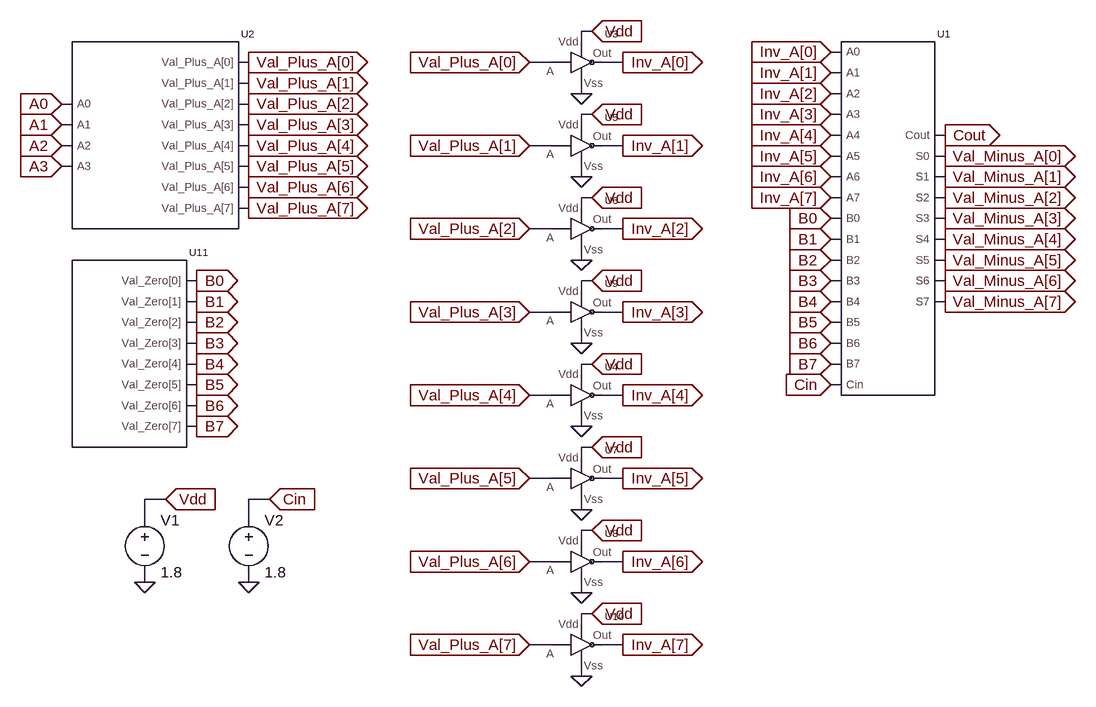
[diagram p0: schematic Val_Minus_A.asc]
Val_Minus_A.asc, the LTspice schematic file:
Version 4
SHEET 1 1636 744
WIRE 320 -640 304 -640
WIRE 304 -624 304 -640
WIRE 704 -608 688 -608
WIRE -208 -592 -224 -592
WIRE 256 -592 224 -592
WIRE 368 -592 336 -592
WIRE 704 -576 688 -576
WIRE -208 -560 -224 -560
WIRE 304 -544 304 -560
WIRE 704 -544 688 -544
WIRE -480 -528 -496 -528
WIRE -208 -528 -224 -528
WIRE 320 -512 304 -512
WIRE 704 -512 688 -512
WIRE -480 -496 -496 -496
WIRE -208 -496 -224 -496
WIRE 304 -496 304 -512
WIRE 704 -480 688 -480
WIRE 864 -480 848 -480
WIRE -480 -464 -496 -464
WIRE -208 -464 -224 -464
WIRE 256 -464 224 -464
WIRE 368 -464 336 -464
WIRE 704 -448 688 -448
WIRE 864 -448 848 -448
WIRE -480 -432 -496 -432
WIRE -208 -432 -224 -432
WIRE 304 -416 304 -432
WIRE 704 -416 688 -416
WIRE 864 -416 848 -416
WIRE -208 -400 -224 -400
WIRE 320 -384 304 -384
WIRE 704 -384 688 -384
WIRE 864 -384 848 -384
WIRE -208 -368 -224 -368
WIRE 304 -368 304 -384
WIRE 704 -352 688 -352
WIRE 864 -352 848 -352
WIRE 256 -336 224 -336
WIRE 368 -336 336 -336
WIRE 704 -320 688 -320
WIRE 864 -320 848 -320
WIRE 304 -288 304 -304
WIRE 704 -288 688 -288
WIRE 864 -288 848 -288
WIRE -288 -256 -304 -256
WIRE 320 -256 304 -256
WIRE 704 -256 688 -256
WIRE 864 -256 848 -256
WIRE 304 -240 304 -256
WIRE -288 -224 -304 -224
WIRE 704 -224 688 -224
WIRE 864 -224 848 -224
WIRE 256 -208 224 -208
WIRE 368 -208 336 -208
WIRE -288 -192 -304 -192
WIRE 704 -192 688 -192
WIRE -288 -160 -304 -160
WIRE 304 -160 304 -176
WIRE 704 -160 688 -160
WIRE -288 -128 -304 -128
WIRE 320 -128 304 -128
WIRE 704 -128 688 -128
WIRE 304 -112 304 -128
WIRE -288 -96 -304 -96
WIRE 704 -96 688 -96
WIRE 256 -80 224 -80
WIRE 368 -80 336 -80
WIRE -288 -64 -304 -64
WIRE -288 -32 -304 -32
WIRE 304 -32 304 -48
WIRE 320 0 304 0
WIRE 304 16 304 0
WIRE 256 48 224 48
WIRE 368 48 336 48
WIRE -336 80 -368 80
WIRE -176 80 -208 80
WIRE 304 96 304 80
WIRE -368 112 -368 80
WIRE -208 112 -208 80
WIRE 320 128 304 128
WIRE 304 144 304 128
WIRE 256 176 224 176
WIRE 368 176 336 176
WIRE -368 208 -368 192
WIRE -208 208 -208 192
WIRE 304 224 304 208
WIRE 320 256 304 256
WIRE 304 272 304 256
WIRE 256 304 224 304
WIRE 368 304 336 304
WIRE 304 352 304 336
FLAG 304 -544 0
FLAG 320 -640 Vdd
IOPIN 320 -640 In
FLAG 304 -416 0
FLAG 320 -512 Vdd
IOPIN 320 -512 In
FLAG 304 -288 0
FLAG 320 -384 Vdd
IOPIN 320 -384 In
FLAG 304 -160 0
FLAG 320 -256 Vdd
IOPIN 320 -256 In
FLAG -208 -592 Val_Plus_A[0]
IOPIN -208 -592 Out
FLAG -208 -560 Val_Plus_A[1]
IOPIN -208 -560 Out
FLAG -208 -528 Val_Plus_A[2]
IOPIN -208 -528 Out
FLAG -208 -496 Val_Plus_A[3]
IOPIN -208 -496 Out
FLAG -208 -464 Val_Plus_A[4]
IOPIN -208 -464 Out
FLAG -208 -432 Val_Plus_A[5]
IOPIN -208 -432 Out
FLAG -208 -400 Val_Plus_A[6]
IOPIN -208 -400 Out
FLAG -208 -368 Val_Plus_A[7]
IOPIN -208 -368 Out
FLAG 224 -592 Val_Plus_A[0]
IOPIN 224 -592 In
FLAG 224 -464 Val_Plus_A[1]
IOPIN 224 -464 In
FLAG 224 -336 Val_Plus_A[2]
IOPIN 224 -336 In
FLAG 224 -208 Val_Plus_A[3]
IOPIN 224 -208 In
FLAG 304 -32 0
FLAG 320 -128 Vdd
IOPIN 320 -128 In
FLAG 304 96 0
FLAG 320 0 Vdd
IOPIN 320 0 In
FLAG 304 224 0
FLAG 320 128 Vdd
IOPIN 320 128 In
FLAG 304 352 0
FLAG 320 256 Vdd
IOPIN 320 256 In
FLAG 224 -80 Val_Plus_A[4]
IOPIN 224 -80 In
FLAG 224 48 Val_Plus_A[5]
IOPIN 224 48 In
FLAG 224 176 Val_Plus_A[6]
IOPIN 224 176 In
FLAG 224 304 Val_Plus_A[7]
IOPIN 224 304 In
FLAG 368 -592 Inv_A[0]
IOPIN 368 -592 Out
FLAG 368 -464 Inv_A[1]
IOPIN 368 -464 Out
FLAG 368 -336 Inv_A[2]
IOPIN 368 -336 Out
FLAG 368 -80 Inv_A[4]
IOPIN 368 -80 Out
FLAG 368 48 Inv_A[5]
IOPIN 368 48 Out
FLAG 368 176 Inv_A[6]
IOPIN 368 176 Out
FLAG 368 -208 Inv_A[3]
IOPIN 368 -208 Out
FLAG 368 304 Inv_A[7]
IOPIN 368 304 Out
FLAG -368 208 0
FLAG -336 80 Vdd
IOPIN -336 80 In
FLAG 688 -608 Inv_A[0]
IOPIN 688 -608 In
FLAG 688 -576 Inv_A[1]
IOPIN 688 -576 In
FLAG 688 -544 Inv_A[2]
IOPIN 688 -544 In
FLAG 688 -512 Inv_A[3]
IOPIN 688 -512 In
FLAG 688 -480 Inv_A[4]
IOPIN 688 -480 In
FLAG 688 -448 Inv_A[5]
IOPIN 688 -448 In
FLAG 688 -416 Inv_A[6]
IOPIN 688 -416 In
FLAG 688 -384 Inv_A[7]
IOPIN 688 -384 In
FLAG -288 -256 B0
IOPIN -288 -256 Out
FLAG -288 -224 B1
IOPIN -288 -224 Out
FLAG -288 -192 B2
IOPIN -288 -192 Out
FLAG -288 -160 B3
IOPIN -288 -160 Out
FLAG -288 -128 B4
IOPIN -288 -128 Out
FLAG -288 -96 B5
IOPIN -288 -96 Out
FLAG -288 -64 B6
IOPIN -288 -64 Out
FLAG -288 -32 B7
IOPIN -288 -32 Out
FLAG 688 -352 B0
IOPIN 688 -352 In
FLAG 688 -320 B1
IOPIN 688 -320 In
FLAG 688 -288 B2
IOPIN 688 -288 In
FLAG 688 -256 B3
IOPIN 688 -256 In
FLAG 688 -224 B4
IOPIN 688 -224 In
FLAG 688 -192 B5
IOPIN 688 -192 In
FLAG 688 -160 B6
IOPIN 688 -160 In
FLAG 688 -128 B7
IOPIN 688 -128 In
FLAG 688 -96 Cin
IOPIN 688 -96 In
FLAG 864 -480 Cout
IOPIN 864 -480 Out
FLAG 864 -448 Val_Minus_A[0]
IOPIN 864 -448 Out
FLAG 864 -416 Val_Minus_A[1]
IOPIN 864 -416 Out
FLAG 864 -384 Val_Minus_A[2]
IOPIN 864 -384 Out
FLAG 864 -352 Val_Minus_A[3]
IOPIN 864 -352 Out
FLAG 864 -320 Val_Minus_A[4]
IOPIN 864 -320 Out
FLAG 864 -288 Val_Minus_A[5]
IOPIN 864 -288 Out
FLAG 864 -256 Val_Minus_A[6]
IOPIN 864 -256 Out
FLAG 864 -224 Val_Minus_A[7]
IOPIN 864 -224 Out
FLAG -208 208 0
FLAG -176 80 Cin
IOPIN -176 80 In
FLAG -496 -528 A0
IOPIN -496 -528 In
FLAG -496 -496 A1
IOPIN -496 -496 In
FLAG -496 -464 A2
IOPIN -496 -464 In
FLAG -496 -432 A3
IOPIN -496 -432 In
SYMBOL 8_Bit_CLA 784 -352 R0
SYMATTR InstName U1
SYMBOL Val_Plus_A -368 -512 R0
SYMATTR InstName U2
SYMBOL NOT1 288 -592 R0
SYMATTR InstName U3
SYMBOL NOT1 288 -464 R0
SYMATTR InstName U5
SYMBOL NOT1 288 -336 R0
SYMATTR InstName U6
SYMBOL NOT1 288 -208 R0
SYMATTR InstName U9
SYMBOL NOT1 288 -80 R0
SYMATTR InstName U4
SYMBOL NOT1 288 48 R0
SYMATTR InstName U7
SYMBOL NOT1 288 176 R0
SYMATTR InstName U8
SYMBOL NOT1 288 304 R0
SYMATTR InstName U10
SYMBOL voltage -368 96 R0
WINDOW 123 0 0 Left 0
WINDOW 39 0 0 Left 0
SYMATTR InstName V1
SYMATTR Value 1.8
SYMBOL Val_Zero -320 -192 R0
SYMATTR InstName U11
SYMBOL voltage -208 96 R0
WINDOW 123 0 0 Left 0
WINDOW 39 0 0 Left 0
SYMATTR InstName V2
SYMATTR Value 1.8

The netlist it stands for:
* Val_Minus_A.asc
XU1 Inv_A[0] Inv_A[1] Inv_A[2] Inv_A[3] Inv_A[4] Inv_A[5] Inv_A[6] Inv_A[7] B0 B1 B2 B3 B4 B5 B6 B7 Cin Cout Val_Minus_A[0] Val_Minus_A[1] Val_Minus_A[2] Val_Minus_A[3] Val_Minus_A[4] Val_Minus_A[5] Val_Minus_A[6] Val_Minus_A[7] 8_Bit_CLA  ; pins A0 A1 A2 A3 A4 A5 A6 A7 B0 B1 B2 B3 B4 B5 B6 B7 Cin Cout S0 S1 S2 S3 S4 S5 S6 S7
XU2 A0 A1 A2 A3 Val_Plus_A[0] Val_Plus_A[1] Val_Plus_A[2] Val_Plus_A[3] Val_Plus_A[4] Val_Plus_A[5] Val_Plus_A[6] Val_Plus_A[7] Val_Plus_A  ; pins A0 A1 A2 A3 Val_Plus_A[0] Val_Plus_A[1] Val_Plus_A[2] Val_Plus_A[3] Val_Plus_A[4] Val_Plus_A[5] Val_Plus_A[6] Val_Plus_A[7]
XU3 Vdd 0 Val_Plus_A[0] Inv_A[0] NOT1  ; pins Vdd Vss A Out
XU5 Vdd 0 Val_Plus_A[1] Inv_A[1] NOT1  ; pins Vdd Vss A Out
XU6 Vdd 0 Val_Plus_A[2] Inv_A[2] NOT1  ; pins Vdd Vss A Out
XU9 Vdd 0 Val_Plus_A[3] Inv_A[3] NOT1  ; pins Vdd Vss A Out
XU4 Vdd 0 Val_Plus_A[4] Inv_A[4] NOT1  ; pins Vdd Vss A Out
XU7 Vdd 0 Val_Plus_A[5] Inv_A[5] NOT1  ; pins Vdd Vss A Out
XU8 Vdd 0 Val_Plus_A[6] Inv_A[6] NOT1  ; pins Vdd Vss A Out
XU10 Vdd 0 Val_Plus_A[7] Inv_A[7] NOT1  ; pins Vdd Vss A Out
V1 Vdd 0 1.8
XU11 B0 B1 B2 B3 B4 B5 B6 B7 Val_Zero  ; pins Val_Zero[0] Val_Zero[1] Val_Zero[2] Val_Zero[3] Val_Zero[4] Val_Zero[5] Val_Zero[6] Val_Zero[7]
V2 Cin 0 1.8
.lib 8_Bit_CLA.sub
.lib Val_Plus_A.sub
.lib NOT1.sub
.lib Val_Zero.sub
.backanno
.end